# Altium schematic sheet CPU.SchDoc
size A3
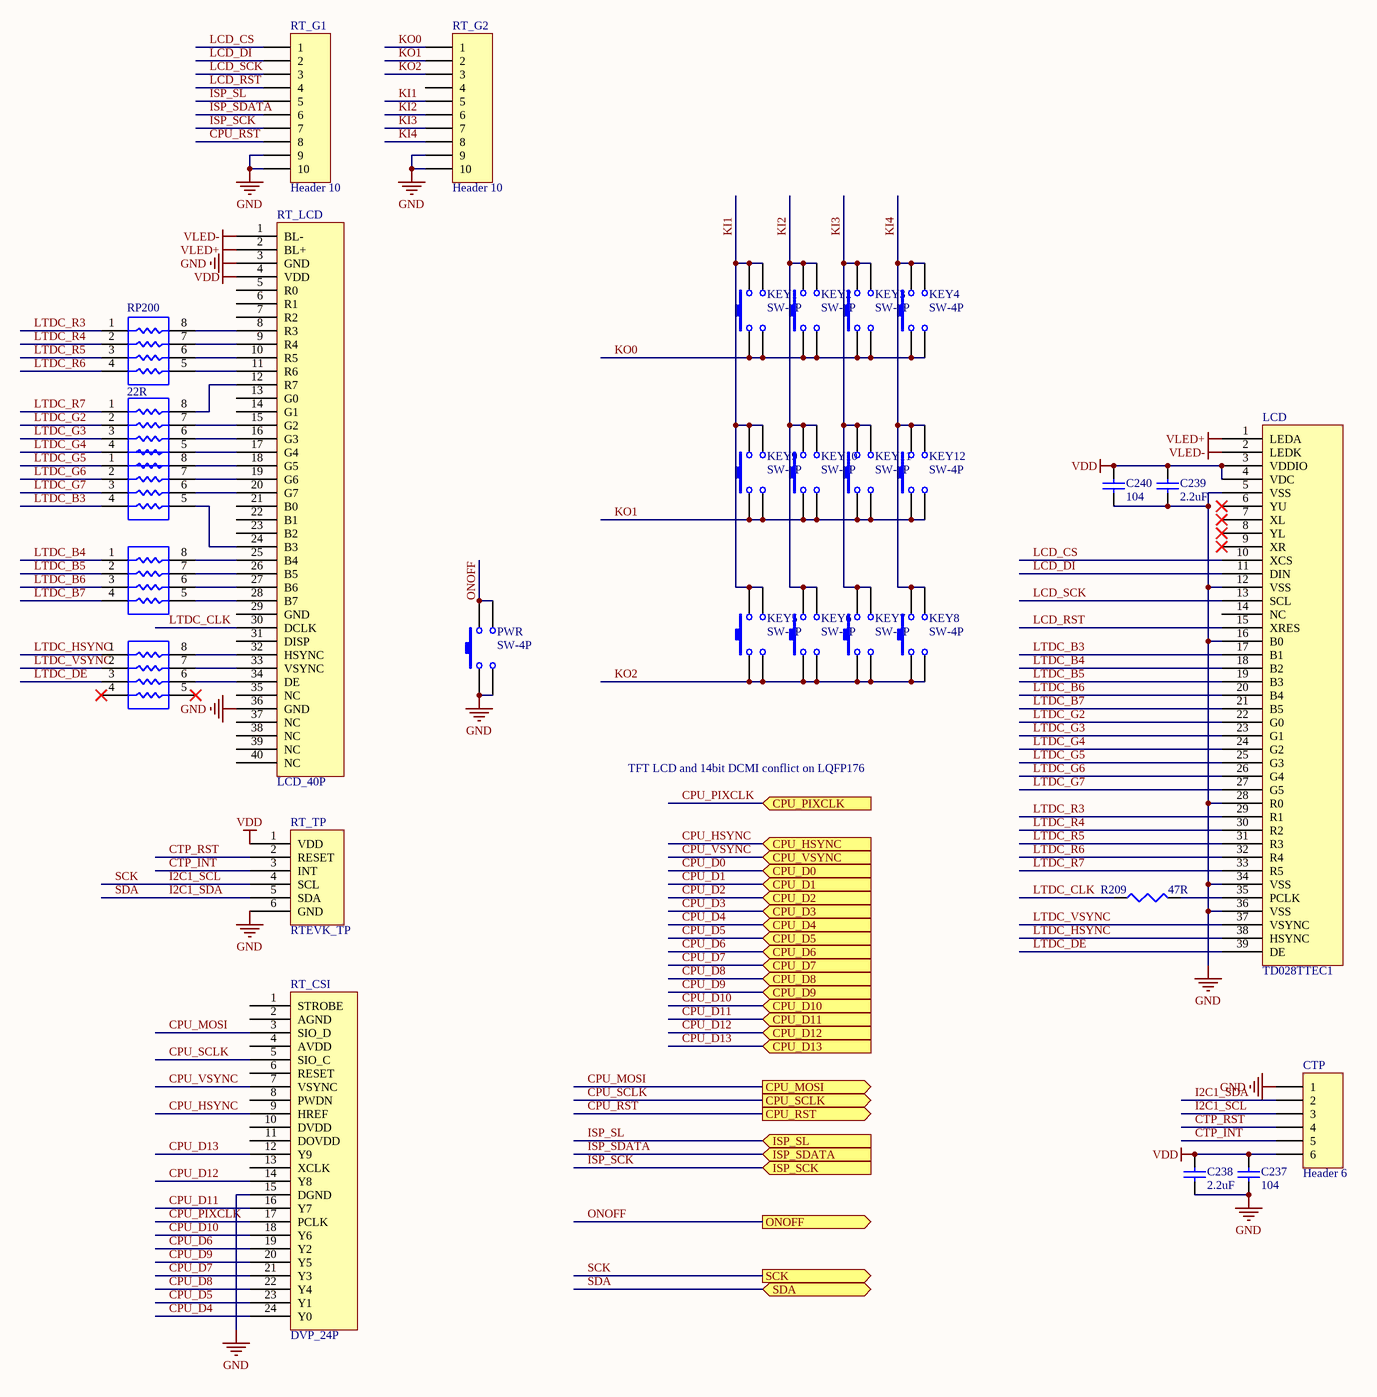
[diagram p0: CPU.SchDoc]

## Parts
C237  104  [C0402]
C238  2.2uF  [C0603]
C239  2.2uF  [C0603]
C240  104  [C0402]
CTP  Header 6  [CTP]
KEY1  SW-4P  [KEY-4P]
KEY2  SW-4P  [KEY-4P]
KEY3  SW-4P  [KEY-4P]
KEY4  SW-4P  [KEY-4P]
KEY5  SW-4P  [KEY-4P]
KEY6  SW-4P  [KEY-4P]
KEY7  SW-4P  [KEY-4P]
KEY8  SW-4P  [KEY-4P]
KEY9  SW-4P  [KEY-4P]
KEY10  SW-4P  [KEY-4P]
KEY11  SW-4P  [KEY-4P]
KEY12  SW-4P  [KEY-4P]
LCD  TD028TTEC1  [FPC_39]
PWR  SW-4P  [KEY-4P]
R209  47R  [R0603]
RP200  22R  [R0402S4]
RP201  22R  [R0402S4]  (value not drawn)
RP202  22R  [R0402S4]  (value not drawn)
RP203  22R  [R0402S4]  (value not drawn)
RP204  22R  [R0402S4]  (value not drawn)
RT_CSI  DVP_24P  [24PIN-0.5MM]
RT_G1  Header 10  [HEADER10]
RT_G2  Header 10  [HEADER10]
RT_LCD  LCD_40P  [40PIN-0.5MM]
RT_TP  RTEVK_TP  [CTP]

## Ports
CPU_D0 (in), CPU_D1 (in), CPU_D2 (in), CPU_D3 (in), CPU_D4 (in), CPU_D5 (in), CPU_D6 (in), CPU_D7 (in), CPU_D8 (in), CPU_D9 (in), CPU_D10 (in), CPU_D11 (in), CPU_D12 (in), CPU_D13 (in), CPU_HSYNC (in), CPU_MOSI (out), CPU_PIXCLK (in), CPU_RST (out), CPU_SCLK (out), CPU_VSYNC (in), ISP_SCK (in), ISP_SDATA (in), ISP_SL (in), ONOFF (out), SCK (out), SDA (bidir)

## Nets
GND: C237.1 C238.1 C239.1 C240.1 CTP.1 LCD.5(VSS) LCD.12(VSS) LCD.16(B0) LCD.28(R0) LCD.34(VSS) LCD.36(VSS) PWR.1 PWR.3 RT_CSI.15(DGND) RT_G1.9 RT_G1.10 RT_G2.9 RT_G2.10 RT_LCD.3(GND) RT_LCD.36(GND) RT_TP.6(GND)
VDD: C237.2 C238.2 C239.2 C240.2 CTP.6 LCD.3(VDDIO) LCD.4(VDC) RT_LCD.4(VDD) RT_TP.1(VDD)
VLED+: LCD.1(LEDA) RT_LCD.2(BL+)
VLED-: LCD.2(LEDK) RT_LCD.1(BL-)
CPU_D0: port CPU_D0
CPU_D1: port CPU_D1
CPU_D2: port CPU_D2
CPU_D3: port CPU_D3
CPU_D4: RT_CSI.24(Y0) ; port CPU_D4
CPU_D5: RT_CSI.23(Y1) ; port CPU_D5
CPU_D6: RT_CSI.19(Y2) ; port CPU_D6
CPU_D7: RT_CSI.21(Y3) ; port CPU_D7
CPU_D8: RT_CSI.22(Y4) ; port CPU_D8
CPU_D9: RT_CSI.20(Y5) ; port CPU_D9
CPU_D10: RT_CSI.18(Y6) ; port CPU_D10
CPU_D11: RT_CSI.16(Y7) ; port CPU_D11
CPU_D12: RT_CSI.14(Y8) ; port CPU_D12
CPU_D13: RT_CSI.12(Y9) ; port CPU_D13
CPU_HSYNC: RT_CSI.9(HREF) ; port CPU_HSYNC
CPU_MOSI: RT_CSI.3(SIO_D) ; port CPU_MOSI
CPU_PIXCLK: RT_CSI.17(PCLK) ; port CPU_PIXCLK
CPU_RST: RT_G1.8 ; port CPU_RST
CPU_SCLK: RT_CSI.5(SIO_C) ; port CPU_SCLK
CPU_VSYNC: RT_CSI.7(VSYNC) ; port CPU_VSYNC
CTP_INT: CTP.5 RT_TP.3(INT)
CTP_RST: CTP.4 RT_TP.2(RESET)
I2C1_SCL: CTP.3 RT_TP.4(SCL) ; port SCK  [also labelled SCK]
I2C1_SDA: CTP.2 RT_TP.5(SDA) ; port SDA  [also labelled SDA]
ISP_SCK: RT_G1.7 ; port ISP_SCK
ISP_SDATA: RT_G1.6 ; port ISP_SDATA
ISP_SL: RT_G1.5 ; port ISP_SL
KI1: KEY1.2 KEY1.4 KEY5.2 KEY5.4 KEY9.2 KEY9.4 RT_G2.5
KI2: KEY2.2 KEY2.4 KEY6.2 KEY6.4 KEY10.2 KEY10.4 RT_G2.6
KI3: KEY3.2 KEY3.4 KEY7.2 KEY7.4 KEY11.2 KEY11.4 RT_G2.7
KI4: KEY4.2 KEY4.4 KEY8.2 KEY8.4 KEY12.2 KEY12.4 RT_G2.8
KO0: KEY1.1 KEY1.3 KEY2.1 KEY2.3 KEY3.1 KEY3.3 KEY4.1 KEY4.3 RT_G2.1
KO1: KEY9.1 KEY9.3 KEY10.1 KEY10.3 KEY11.1 KEY11.3 KEY12.1 KEY12.3 RT_G2.2
KO2: KEY5.1 KEY5.3 KEY6.1 KEY6.3 KEY7.1 KEY7.3 KEY8.1 KEY8.3 RT_G2.3
LCD_CS: LCD.10(XCS) RT_G1.1
LCD_DI: LCD.11(DIN) RT_G1.2
LCD_RST: LCD.15(XRES) RT_G1.4
LCD_SCK: LCD.13(SCL) RT_G1.3
LTDC_B3: LCD.17(B1) RP202.4
LTDC_B4: LCD.18(B2) RP203.1
LTDC_B5: LCD.19(B3) RP203.2
LTDC_B6: LCD.20(B4) RP203.3
LTDC_B7: LCD.21(B5) RP203.4
LTDC_CLK: R209.1 RT_LCD.30(DCLK)
LTDC_DE: LCD.39(DE) RP204.3
LTDC_G2: LCD.22(G0) RP201.2
LTDC_G3: LCD.23(G1) RP201.3
LTDC_G4: LCD.24(G2) RP201.4
LTDC_G5: LCD.25(G3) RP202.1
LTDC_G6: LCD.26(G4) RP202.2
LTDC_G7: LCD.27(G5) RP202.3
LTDC_HSYNC: LCD.38(HSYNC) RP204.1
LTDC_R3: LCD.29(R1) RP200.1
LTDC_R4: LCD.30(R2) RP200.2
LTDC_R5: LCD.31(R3) RP200.3
LTDC_R6: LCD.32(R4) RP200.4
LTDC_R7: LCD.33(R5) RP201.1
LTDC_VSYNC: LCD.37(VSYNC) RP204.2
ONOFF: PWR.2 PWR.4 ; port ONOFF
NetLCD_35: LCD.35(PCLK) R209.2
NetRP200_5: RP200.5 RT_LCD.11(R6)
NetRP200_6: RP200.6 RT_LCD.10(R5)
NetRP200_7: RP200.7 RT_LCD.9(R4)
NetRP200_8: RP200.8 RT_LCD.8(R3)
NetRP201_5: RP201.5 RT_LCD.17(G4)
NetRP201_6: RP201.6 RT_LCD.16(G3)
NetRP201_7: RP201.7 RT_LCD.15(G2)
NetRP201_8: RP201.8 RT_LCD.12(R7)
NetRP202_5: RP202.5 RT_LCD.24(B3)
NetRP202_6: RP202.6 RT_LCD.20(G7)
NetRP202_7: RP202.7 RT_LCD.19(G6)
NetRP202_8: RP202.8 RT_LCD.18(G5)
NetRP203_5: RP203.5 RT_LCD.28(B7)
NetRP203_6: RP203.6 RT_LCD.27(B6)
NetRP203_7: RP203.7 RT_LCD.26(B5)
NetRP203_8: RP203.8 RT_LCD.25(B4)
NetRP204_6: RP204.6 RT_LCD.34(DE)
NetRP204_7: RP204.7 RT_LCD.33(VSYNC)
NetRP204_8: RP204.8 RT_LCD.32(HSYNC)

Not connected (* = marked no-connect by the designer): LCD 6(YU)* 7(XL)* 8(YL)* 9(XR)* 14(NC); RP204 4* 5*; RT_CSI 1(STROBE) 2(AGND) 4(AVDD) 6(RESET) 8(PWDN) 10(DVDD) 11(DOVDD) 13(XCLK); RT_G2 4; RT_LCD 5(R0) 6(R1) 7(R2) 13(G0) 14(G1) 21(B0) 22(B1) 23(B2) 29(GND) 31(DISP) 35(NC) 37(NC) 38(NC) 39(NC) 40(NC)

## Notes on the sheet
- TFT LCD and 14bit DCMI conflict on LQFP176

## Library data of the parts
C237-C240 = Cap Semi: Capacitor (Semiconductor SIM Model); Value: 100pF; Published: 8-Jun-2000; LatestRevisionDate: 29-May-2009; LatestRevisionNote: IPC-7351 Footprint Added.; PackageReference: C1206; Publisher: Altium Limited; PackageDescription: Chip Capacitor
CTP = Header 6: Header, 6-Pin; LatestRevisionDate: 17-Jul-2002; LatestRevisionNote: Re-released for DXP Platform.; Publisher: Altium Limited
KEY1-KEY12 PWR = SW-4P: Switch; Published: 24-Mar-1999; LatestRevisionDate: 17-Jul-2002; LatestRevisionNote: Re-released for DXP Platform.; PackageReference: SPST-2; Publisher: Altium Limited; PackageDescription: Switch; 2 Leads
R209 = Res3: Resistor; Value: 1K; Published: 8-Jun-2000; LatestRevisionDate: 29-May-2009; LatestRevisionNote: IPC-7351 Footprint Added.; PackageReference: J1-0603; Publisher: Altium Limited; PackageDescription: Chip Resistor
RP200-RP204 = ResPack: Isolated Resistor Network; Value: 1K; Published: 24-Mar-1999; LatestRevisionDate: 29-May-2009; LatestRevisionNote: IPC-7351 Footprint Added.; PackageReference: SO-16; Publisher: Altium Limited; PackageDescription: 16-Pin Small Outline Integrated Circuit 1.27 mm Pitch; Code_JEDEC: MS-012-AC; Code_IPC: SOIC127P600-16
RT_G1 RT_G2 = Header 10: Header, 10-Pin; LatestRevisionDate: 17-Jul-2002; LatestRevisionNote: Re-released for DXP Platform.; Publisher: Altium Limited